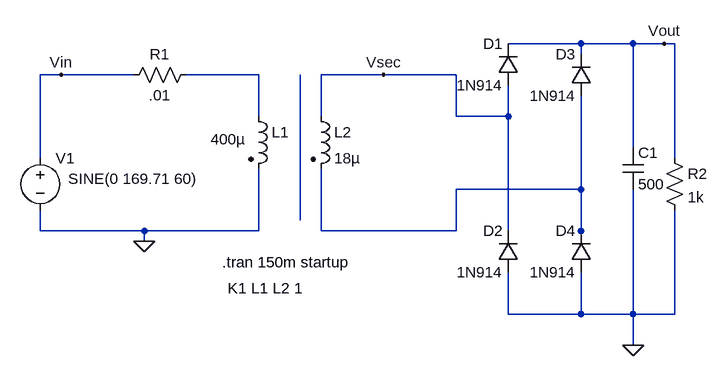
[diagram p0: schematic linear_1.asc]
linear_1.asc, the LTspice schematic file:
Version 4
SHEET 1 900 680
WIRE 704 80 592 80
WIRE 784 80 704 80
WIRE 832 80 784 80
WIRE 848 80 832 80
WIRE 704 96 704 80
WIRE -96 128 -128 128
WIRE 16 128 -96 128
WIRE 208 128 96 128
WIRE 400 128 304 128
WIRE 512 128 400 128
WIRE 208 192 208 128
WIRE 304 192 304 128
WIRE 512 192 512 128
WIRE 592 192 592 144
WIRE 592 192 512 192
WIRE 784 240 784 80
WIRE -128 256 -128 128
WIRE 848 256 848 80
WIRE 704 304 704 160
WIRE 704 304 512 304
WIRE 272 352 272 128
WIRE -128 368 -128 336
WIRE 32 368 -128 368
WIRE 208 368 208 272
WIRE 208 368 32 368
WIRE 304 368 304 272
WIRE 512 368 512 304
WIRE 512 368 304 368
WIRE 592 368 592 192
WIRE 704 368 704 304
WIRE 32 384 32 368
WIRE 704 384 704 368
WIRE 592 496 592 432
WIRE 704 496 704 432
WIRE 704 496 592 496
WIRE 784 496 784 304
WIRE 784 496 704 496
WIRE 848 496 848 336
WIRE 848 496 784 496
WIRE 784 544 784 496
FLAG 32 384 0
FLAG -96 128 Vin
FLAG 784 544 0
FLAG 400 128 Vsec
FLAG 832 80 Vout
SYMBOL Voltage -128 240 R0
WINDOW 3 43 48 Left 2
SYMATTR InstName V1
SYMATTR Value SINE(0 169.71 60)
SYMBOL Res 112 112 R90
WINDOW 0 0 56 VBottom 2
WINDOW 3 32 56 VTop 2
SYMATTR InstName R1
SYMATTR Value .01
SYMBOL ind2 192 176 R0
WINDOW 3 -58 51 Left 2
SYMATTR InstName L1
SYMATTR Value 400µ
SYMATTR Type ind
SYMBOL ind2 288 176 R0
SYMATTR InstName L2
SYMATTR Value 18µ
SYMATTR Type ind
SYMBOL diode 608 144 R180
WINDOW 0 24 64 Left 2
WINDOW 3 24 0 Left 2
SYMATTR InstName D1
SYMATTR Value 1N914
SYMBOL diode 608 432 R180
WINDOW 0 24 64 Left 2
WINDOW 3 24 0 Left 2
SYMATTR InstName D2
SYMATTR Value 1N914
SYMBOL diode 720 160 R180
WINDOW 0 24 64 Left 2
WINDOW 3 24 0 Left 2
SYMATTR InstName D3
SYMATTR Value 1N914
SYMBOL diode 720 432 R180
WINDOW 0 24 64 Left 2
WINDOW 3 24 0 Left 2
SYMATTR InstName D4
SYMATTR Value 1N914
SYMBOL Cap 768 240 R0
SYMATTR InstName C1
SYMATTR Value 500
SYMBOL Res 832 240 R0
SYMATTR InstName R2
SYMATTR Value 1k
TEXT 152 416 Left 2 !.tran 150m startup
TEXT 160 456 Left 2 !K1 L1 L2 1

The netlist it stands for:
* linear_1.asc
V1 Vin 0 SINE(0 169.71 60)
R1 N001 Vin .01
L1 N001 0 400µ
L2 Vsec N002 18µ
D1 Vsec Vout 1N914
D2 0 Vsec 1N914
D3 N002 Vout 1N914
D4 0 N002 1N914
C1 Vout 0 500
R2 Vout 0 1k
.model D D
.lib standard.dio
.tran 150m startup
K1 L1 L2 1
.backanno
.end